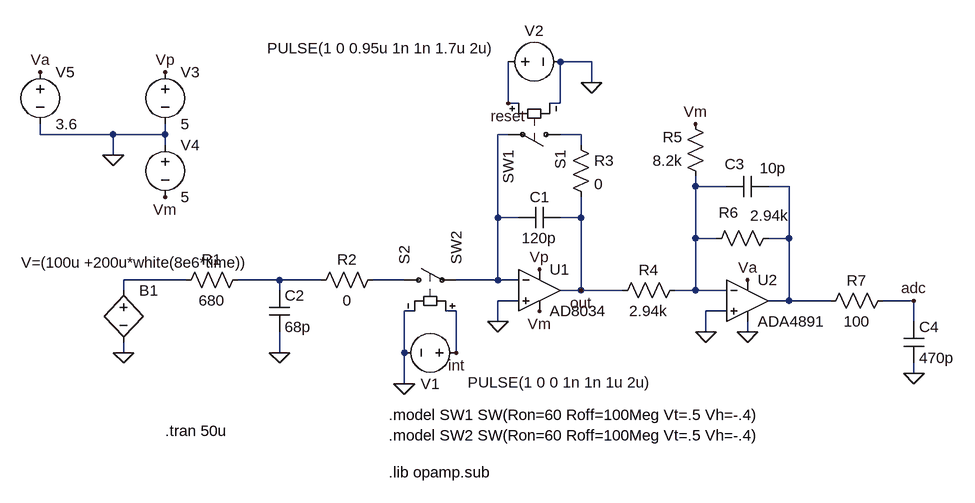
[diagram p0: schematic gated_int.asc]
gated_int.asc, the LTspice schematic file:
Version 4
SHEET 1 1076 928
WIRE 512 -176 464 -176
WIRE 512 -144 512 -176
WIRE 384 -112 384 -176
WIRE 400 -112 384 -112
WIRE 464 -112 464 -176
WIRE 464 -112 448 -112
WIRE -336 -64 -336 -80
WIRE -224 -64 -336 -64
WIRE -144 -64 -144 -80
WIRE -144 -64 -224 -64
WIRE 384 -64 368 -64
WIRE 496 -64 464 -64
WIRE -144 -48 -144 -64
WIRE 496 -48 496 -64
WIRE -224 -32 -224 -64
WIRE 672 16 672 0
WIRE 720 16 672 16
WIRE 816 16 784 16
WIRE 368 64 368 -64
WIRE 400 64 368 64
WIRE 496 64 496 32
WIRE 496 64 464 64
WIRE 672 96 672 16
WIRE 704 96 672 96
WIRE 816 96 816 16
WIRE 816 96 784 96
WIRE -112 160 -208 160
WIRE 32 160 -32 160
WIRE 96 160 32 160
WIRE 224 160 176 160
WIRE 368 160 368 64
WIRE 368 160 304 160
WIRE 400 160 368 160
WIRE -208 176 -208 160
WIRE 32 176 32 160
WIRE 496 176 496 64
WIRE 496 176 464 176
WIRE 560 176 496 176
WIRE 672 176 672 96
WIRE 672 176 640 176
WIRE 720 176 672 176
WIRE 400 192 368 192
WIRE 816 192 816 96
WIRE 816 192 784 192
WIRE 880 192 816 192
WIRE 1008 192 960 192
WIRE 240 208 224 208
WIRE 304 208 288 208
WIRE 720 208 688 208
WIRE 368 224 368 192
WIRE 1008 224 1008 192
WIRE 688 240 688 208
WIRE 752 240 752 224
WIRE -208 272 -208 256
WIRE 32 272 32 240
WIRE 224 272 224 208
WIRE 304 272 304 208
WIRE 1008 304 1008 288
WIRE 224 320 224 272
FLAG 368 224 0
FLAG 32 272 0
FLAG -208 272 0
FLAG 224 320 0
FLAG 512 -144 0
FLAG 304 272 int
FLAG 384 -112 reset
FLAG 496 176 out
FLAG 432 144 Vp
FLAG 432 208 Vm
FLAG -144 -160 Vp
FLAG -144 32 Vm
FLAG -224 -32 0
FLAG -336 -160 Va
FLAG 752 160 Va
FLAG 752 240 0
FLAG 672 -80 Vm
FLAG 1008 304 0
FLAG 1008 192 adc
FLAG 688 240 0
SYMBOL res -16 144 R90
WINDOW 0 0 56 VBottom 2
WINDOW 3 32 56 VTop 2
SYMATTR InstName R1
SYMATTR Value 680
SYMBOL res 192 144 R90
WINDOW 0 0 56 VBottom 2
WINDOW 3 32 56 VTop 2
SYMATTR InstName R2
SYMATTR Value 0
SYMBOL sw 480 -64 R90
SYMATTR InstName S1
SYMATTR Value SW1
SYMBOL sw 208 160 R270
SYMATTR InstName S2
SYMATTR Value SW2
SYMBOL cap 464 48 R90
WINDOW 0 0 32 VBottom 2
WINDOW 3 32 32 VTop 2
SYMATTR InstName C1
SYMATTR Value 120p
SYMBOL cap 16 176 R0
SYMATTR InstName C2
SYMATTR Value 68p
SYMBOL voltage 320 272 R90
WINDOW 0 32 56 VTop 2
WINDOW 3 61 -143 VBottom 2
WINDOW 123 0 0 Left 0
WINDOW 39 0 0 Left 0
SYMATTR InstName V1
SYMATTR Value PULSE(1 0 0 1n 1n 1u 2u)
SYMBOL voltage 368 -176 R270
WINDOW 0 32 56 VTop 2
WINDOW 3 5 -179 VTop 2
WINDOW 123 0 0 Left 0
WINDOW 39 0 0 Left 0
SYMATTR InstName V2
SYMATTR Value PULSE(1 0 0.95u 1n 1n 1.7u 2u)
SYMBOL bv -208 160 R0
WINDOW 3 -157 -27 Left 2
SYMATTR Value V=(100u +200u*white(8e6*time))
SYMATTR InstName B1
SYMBOL voltage -144 -176 R0
WINDOW 123 0 0 Left 0
WINDOW 39 0 0 Left 0
SYMATTR InstName V3
SYMATTR Value 5
SYMBOL voltage -144 -64 R0
WINDOW 123 0 0 Left 0
WINDOW 39 0 0 Left 0
SYMATTR InstName V4
SYMATTR Value 5
SYMBOL res 480 -64 R0
SYMATTR InstName R3
SYMATTR Value 0
SYMBOL Opamps\\AD8034 432 112 R0
SYMATTR InstName U1
SYMBOL Opamps\\ADA4891 752 128 R0
SYMATTR InstName U2
SYMBOL voltage -336 -176 R0
WINDOW 123 0 0 Left 0
WINDOW 39 0 0 Left 0
SYMATTR InstName V5
SYMATTR Value 3.6
SYMBOL res 656 160 R90
WINDOW 0 0 56 VBottom 2
WINDOW 3 32 56 VTop 2
SYMATTR InstName R4
SYMATTR Value 2.94k
SYMBOL res 688 16 R180
WINDOW 0 36 76 Left 2
WINDOW 3 36 40 Left 2
SYMATTR InstName R5
SYMATTR Value 8.2k
SYMBOL res 800 80 R90
WINDOW 0 -8 77 VBottom 2
WINDOW 3 -35 14 VTop 2
SYMATTR InstName R6
SYMATTR Value 2.94k
SYMBOL cap 784 0 R90
WINDOW 0 -3 52 VBottom 2
WINDOW 3 -28 -7 VTop 2
SYMATTR InstName C3
SYMATTR Value 10p
SYMBOL res 976 176 R90
WINDOW 0 0 56 VBottom 2
WINDOW 3 32 56 VTop 2
SYMATTR InstName R7
SYMATTR Value 100
SYMBOL cap 992 224 R0
SYMATTR InstName C4
SYMATTR Value 470p
TEXT 200 456 Left 2 !.lib opamp.sub
TEXT 200 368 Left 2 !.model SW1 SW(Ron=60 Roff=100Meg Vt=.5 Vh=-.4)\n.model SW2 SW(Ron=60 Roff=100Meg Vt=.5 Vh=-.4)
TEXT -144 392 Left 2 !.tran 50u

The netlist it stands for:
* gated_int.asc
R1 N006 N005 680
R2 N007 N006 0
S1 N002 N001 reset 0 SW1
S2 N007 N001 int 0 SW2
C1 out N001 120p
C2 N006 0 68p
V1 int 0 PULSE(1 0 0 1n 1n 1u 2u)
V2 reset 0 PULSE(1 0 0.95u 1n 1n 1.7u 2u)
B1 N005 0 V=(100u +200u*white(8e6*time))
V3 Vp 0 5
V4 0 Vm 5
R3 N002 out 0
XU1 0 N001 Vp Vm out AD8034  ; pins In+ In- V+ V- OUT
XU2 0 N003 Va 0 N004 ADA4891-1  ; pins In+ In- V+ V- OUT
V5 Va 0 3.6
R4 N003 out 2.94k
R5 N003 Vm 8.2k
R6 N004 N003 2.94k
C3 N004 N003 10p
R7 adc N004 100
C4 adc 0 470p
.lib opamp.sub
.model SW1 SW(Ron=60 Roff=100Meg Vt=.5 Vh=-.4)
.model SW2 SW(Ron=60 Roff=100Meg Vt=.5 Vh=-.4)
.tran 50u
.lib ADA4891-1.lib
.backanno
.end